# Altium project Jetson-Nano-Communication-Shield.PrjPcb
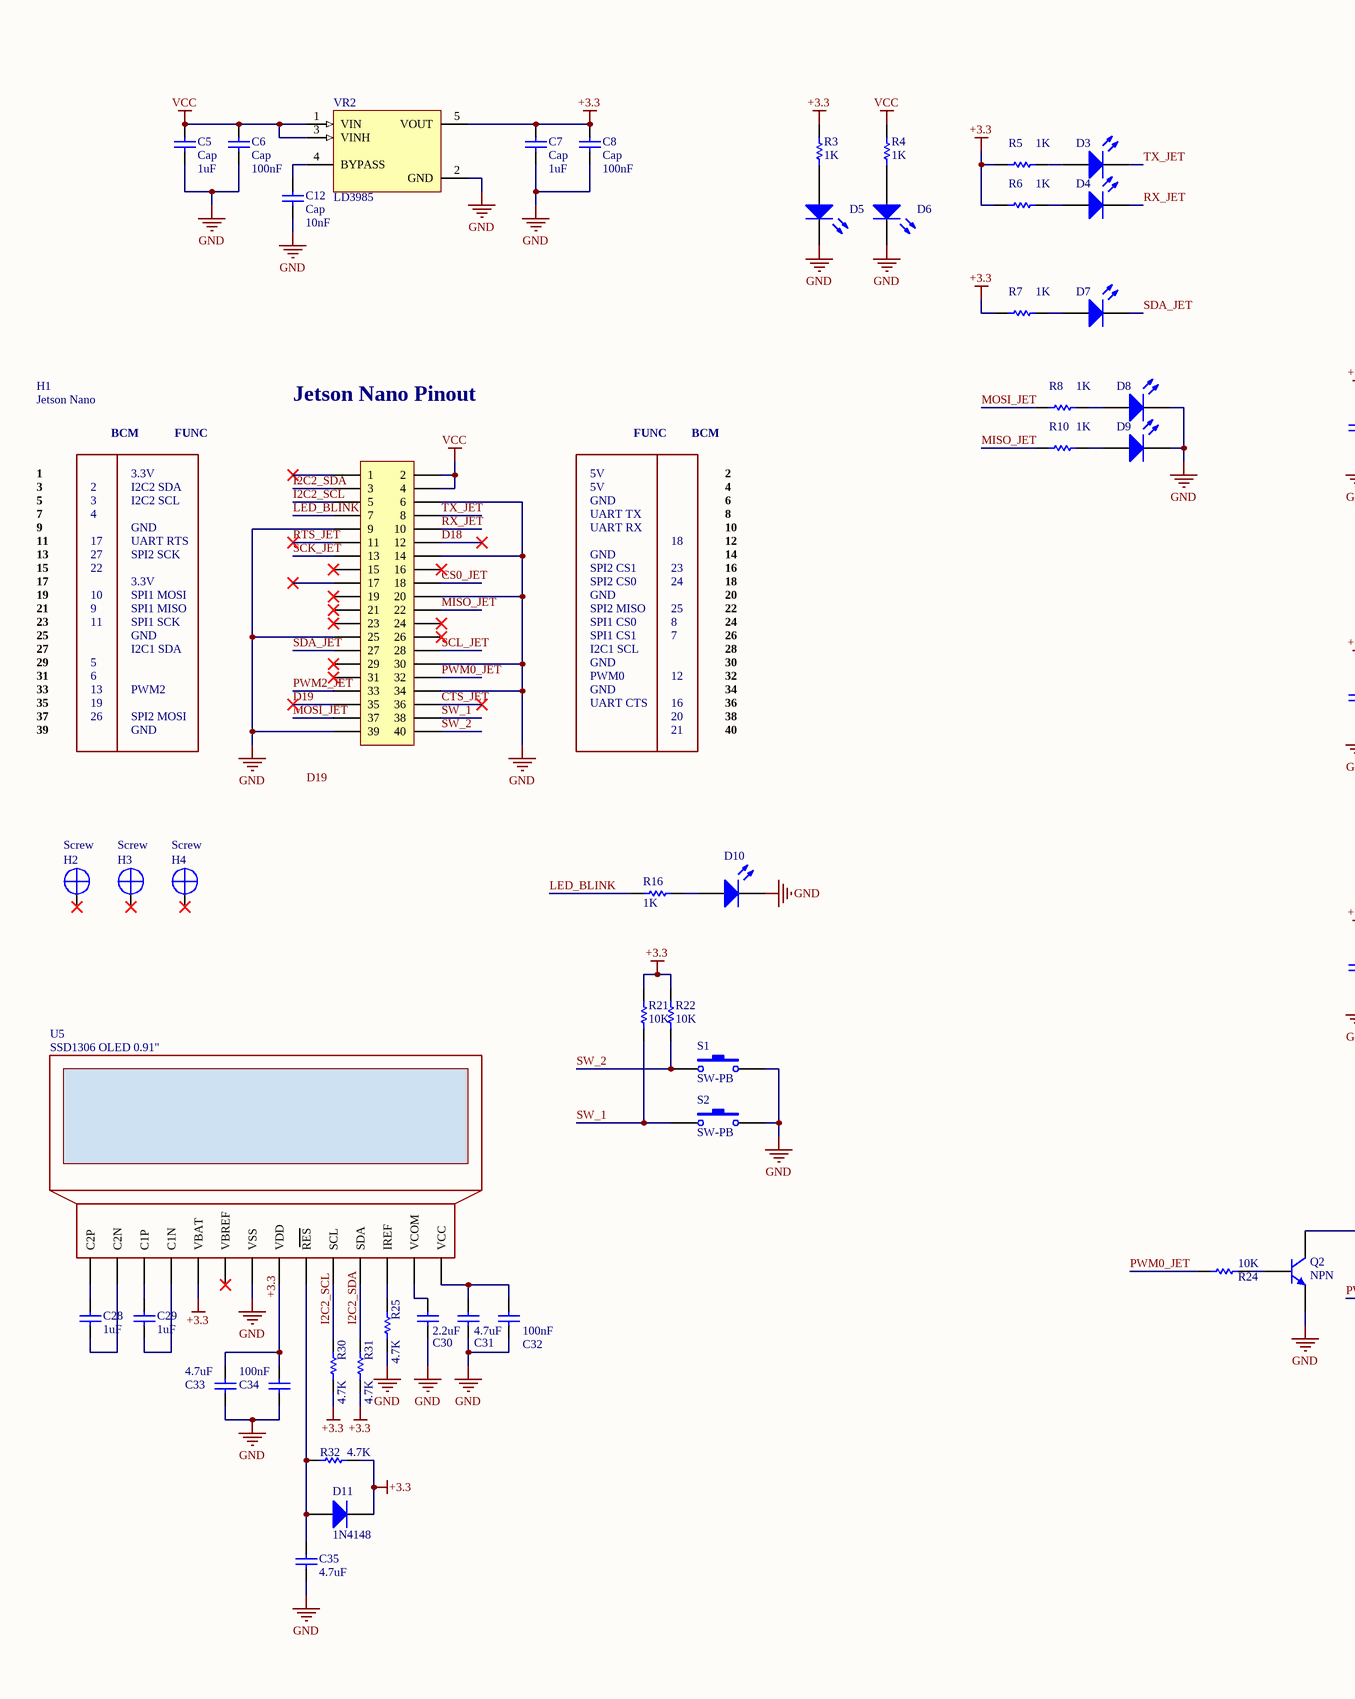
[diagram p0: Communication-Shield.SchDoc, left]
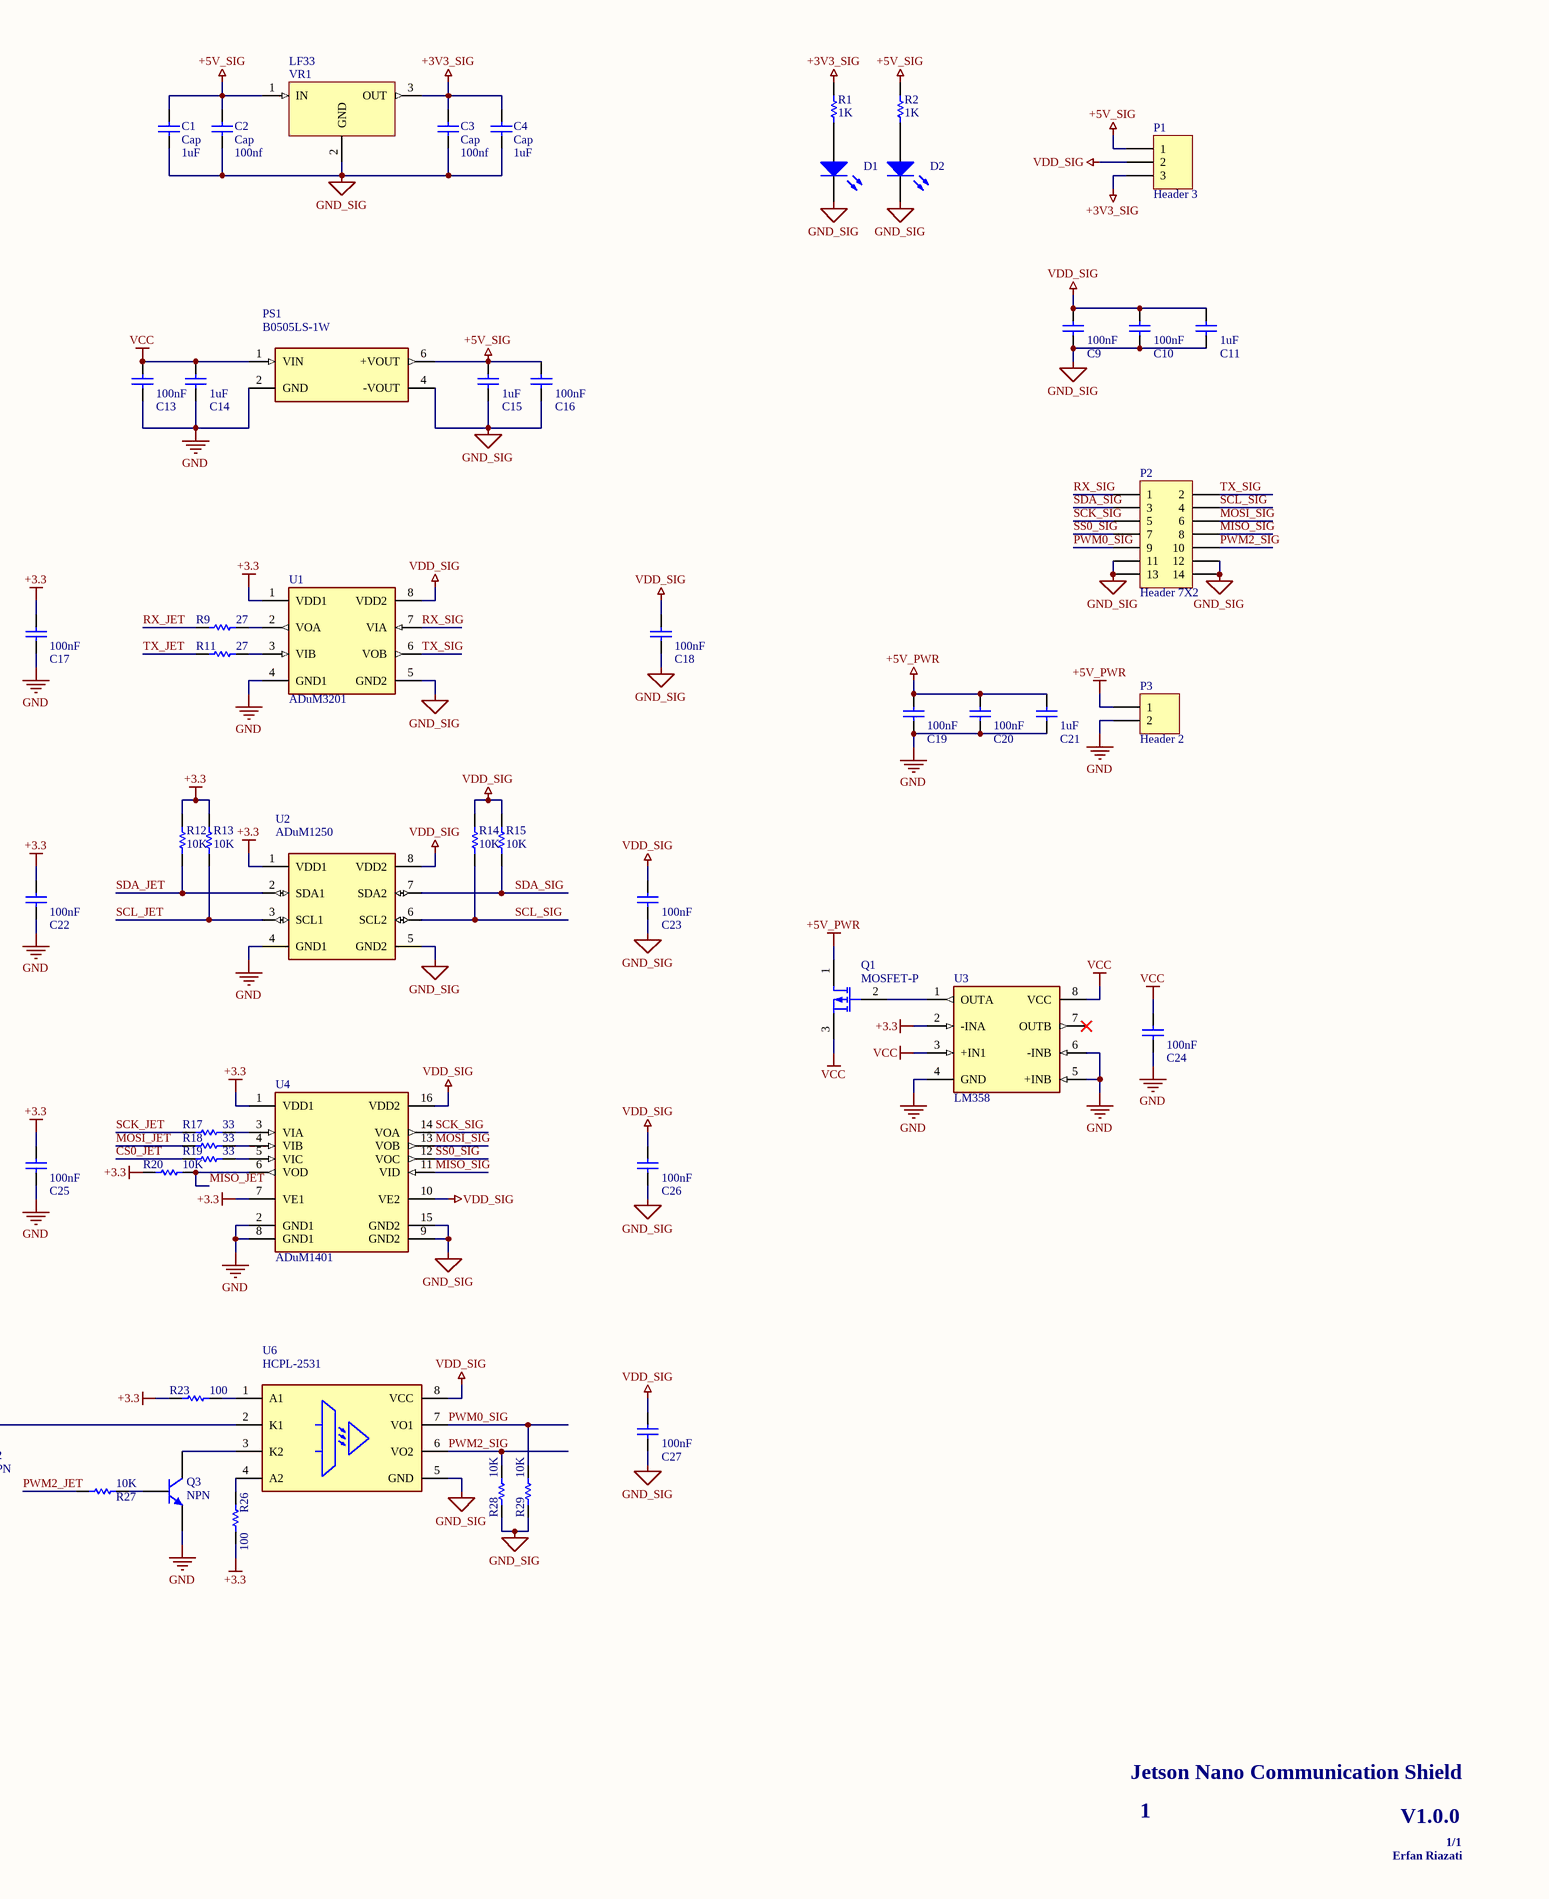
[diagram p1: Communication-Shield.SchDoc, right]
1 sheet, 99 parts. Net scope: global (net labels, ports and power ports of the same name join across sheets).
Board file: Communication-Shield.PcbDoc

## Sheet Communication-Shield.SchDoc
size A2; SheetNumber: 1; SheetTotal: 1; SPICEModelCacheUYUYBKYJ: <root> / <DocumentId>UYUYBKYJ</DocumentId> / <CacheFrame Number="0"> / <Model Name="cap" Kind="MDL"> / <Text>*Default semiconductor capacitor / .MODEL CAP C()</Text> / </Model> / <Model Name="led2" Kind="MDL"> / <Text>*Typ RED,GREEN,YELLOW,AMBER GaAs LED: Vf=2.1V Vr=4V If=40mA trr=3uS / *LED Pinout: 1=A, 2=K / .MODEL LED2 D (IS=93.1P RS=42M N=4.61 BV=4 IBV=10U / + CJO=2.97P VJ=.75 M=.333 TT=4.32U)</Text> / </Model> / <Model Name="diode" Kind="MDL"> / <Text>*Default Diode / *Diode Pinout: A,K / .MODEL DIODE D()</Text> / </Model> / <Model Name="npn" Kind="MDL"> / <Text>*Default NPN BJT / *NPN Trans Pinout: C,B,E / .MODEL NPN NPN()</Text> / </Model> / <Model Name="pmos" Kind="MDL"> / <Text>*Default P-Channel MOSFET / *Pinout: D,G,S / .MODEL PMOS PMOS()</Text> / </Model> / </CacheFrame> / </root>

### Parts
C1  Cap  value 1uF  [C0603]
C2  Cap  value 100nf  [C0603]
C3  Cap  value 100nf  [C0603]
C4  Cap  value 1uF  [C0603]
C5  Cap  value 1uF  [C0603]
C6  Cap  value 100nF  [C0603]
C7  Cap  value 1uF  [C0603]
C8  Cap  value 100nF  [C0603]
C9  value 100nF  [C0603]  (hidden comment: Cap)
C10  value 100nF  [C0603]  (hidden comment: Cap)
C11  value 1uF  [C0603]  (hidden comment: Cap)
C12  Cap  value 10nF  [C0603]
C13  value 100nF  [C0603]  (hidden comment: Cap)
C14  value 1uF  [C0603]  (hidden comment: Cap)
C15  value 1uF  [C0603]  (hidden comment: Cap)
C16  value 100nF  [C0603]  (hidden comment: Cap)
C17  value 100nF  [C0603]  (hidden comment: Cap)
C18  value 100nF  [C0603]  (hidden comment: Cap)
C19  value 100nF  [C0603]  (hidden comment: Cap)
C20  value 100nF  [C0603]  (hidden comment: Cap)
C21  value 1uF  [C0603]  (hidden comment: Cap)
C22  value 100nF  [C0603]  (hidden comment: Cap)
C23  value 100nF  [C0603]  (hidden comment: Cap)
C24  value 100nF  [C0603]  (hidden comment: Cap)
C25  value 100nF  [C0603]  (hidden comment: Cap)
C26  value 100nF  [C0603]  (hidden comment: Cap)
C27  value 100nF  [C0603]  (hidden comment: Cap)
C28  value 1uF  [C0603]  (hidden comment: Cap)
C29  value 1uF  [C0603]  (hidden comment: Cap)
C30  value 2.2uF  [C0603]  (hidden comment: Cap)
C31  value 4.7uF  [C0603]  (hidden comment: Cap)
C32  value 100nF  [C0603]  (hidden comment: Cap)
C33  value 4.7uF  [C0603]  (hidden comment: Cap)
C34  value 100nF  [C0603]  (hidden comment: Cap)
C35  value 4.7uF  [C0603]  (hidden comment: Cap)
D1  Orange  [LED-0805 Green]  (value not drawn)
D2  Orange  [LED-0805 Green]  (value not drawn)
D3  Orange  [LED-0805 Orange]  (value not drawn)
D4  Orange  [LED-0805 Orange]  (value not drawn)
D5  Orange  [LED-0805 Green]  (value not drawn)
D6  Orange  [LED-0805 Green]  (value not drawn)
D7  Orange  [LED-0805 Orange]  (value not drawn)
D8  Orange  [LED-0805 Orange]  (value not drawn)
D9  Orange  [LED-0805 Orange]  (value not drawn)
D10  Orange  [LED-0805 Orange]  (value not drawn)
D11  1N4148  [SOD-323 Diode]
H1  Jetson Nano  [Jetson Nano Header 40-Pin]
H2  Screw  [3mm Screw Hole - 2]
H3  Screw  [3mm Screw Hole - 2]
H4  Screw  [3mm Screw Hole - 2]
P1  Header 3  [Jumper Selector]
P2  Header 7X2  [IDC 14-Pin 2x7]
P3  Header 2  [XH Connector 2-Pin]
PS1  B0505LS-1W  [B0505LS-1W]
Q1  MOSFET-P  [SOT-23]
Q2  NPN  [SOT-23]
Q3  NPN  [SOT-23]
R1  value 1K  [R0603]  (hidden comment: Res1)
R2  value 1K  [R0603]  (hidden comment: Res1)
R3  value 1K  [R0603]  (hidden comment: Res1)
R4  value 1K  [R0603]  (hidden comment: Res1)
R5  value 1K  [R0603]  (hidden comment: Res1)
R6  value 1K  [R0603]  (hidden comment: Res1)
R7  value 1K  [R0603]  (hidden comment: Res1)
R8  value 1K  [R0603]  (hidden comment: Res1)
R9  value 27  [R0603]  (hidden comment: Res1)
R10  value 1K  [R0603]  (hidden comment: Res1)
R11  value 27  [R0603]  (hidden comment: Res1)
R12  value 10K  [R0603]  (hidden comment: Res1)
R13  value 10K  [R0603]  (hidden comment: Res1)
R14  value 10K  [R0603]  (hidden comment: Res1)
R15  value 10K  [R0603]  (hidden comment: Res1)
R16  value 1K  [R0603]  (hidden comment: Res1)
R17  value 33  [R0603]  (hidden comment: Res1)
R18  value 33  [R0603]  (hidden comment: Res1)
R19  value 33  [R0603]  (hidden comment: Res1)
R20  value 10K  [R0603]  (hidden comment: Res1)
R21  value 10K  [R0603]  (hidden comment: Res1)
R22  value 10K  [R0603]  (hidden comment: Res1)
R23  value 100  [R0603]  (hidden comment: Res1)
R24  value 10K  [R0603]  (hidden comment: Res1)
R25  value 4.7K  [R0603]  (hidden comment: Res1)
R26  value 100  [R0603]  (hidden comment: Res1)
R27  value 10K  [R0603]  (hidden comment: Res1)
R28  value 10K  [R0603]  (hidden comment: Res1)
R29  value 10K  [R0603]  (hidden comment: Res1)
R30  value 4.7K  [R0603]  (hidden comment: Res1)
R31  value 4.7K  [R0603]  (hidden comment: Res1)
R32  value 4.7K  [R0603]  (hidden comment: Res1)
S1  SW-PB  [Tactile Switch SMD - 2]
S2  SW-PB  [Tactile Switch SMD - 2]
U1  ADuM3201  [SOIC-8]
U2  ADuM1250  [SOIC-8]
U3  LM358  [SOIC-8]
U4  ADuM1401  [SOIC-16]
U5  SSD1306 OLED 0.91"  [SSD1306 OLED 0.91"]
U6  HCPL-2531  [SOIC-8]
VR1  LF33  [DPAK TO-252]
VR2  LD3985  [SOT23-5]

### Nets
+3.3: C7.2 C8.2 C17.1 C22.1 C25.1 C33.1 C34.1 D11.2(K) R3.1 R5.1 R6.1 R7.1 R12.2 R13.2 R20.1 R21.2 R22.2 R23.2 R26.1 R30.1 R31.1 R32.1 U1.1(VDD1) U2.1(VDD1) U3.2(-INA) U4.1(VDD1) U4.7(VE1) U5.5(VBAT) U5.8(VDD) VR2.5(VOUT)
+3V3_SIG: C3.2 C4.2 P1.3 R1.1 VR1.3(OUT)
+5V_PWR: C19.1 C20.1 C21.1 P3.1 Q1.1(D)
+5V_SIG: C1.2 C2.2 C15.1 C16.1 P1.1 PS1.6(+VOUT) R2.1 VR1.1(IN)
GND: C5.1 C6.1 C7.1 C8.1 C12.1 C13.2 C14.2 C17.2 C19.2 C20.2 C21.2 C22.2 C24.2 C25.2 C30.2 C31.2 C32.2 C33.2 C34.2 C35.2 D5.2(K) D6.2(K) D8.2(K) D9.2(K) D10.2(K) H1.6 H1.9 H1.14 H1.20 H1.25 H1.30 H1.34 H1.39 P3.2 PS1.2(GND) Q2.3(E) Q3.3(E) R25.1 S1.2 S2.2 U1.4(GND1) U2.4(GND1) U3.4(GND) U3.5(+INB) U3.6(-INB) U4.2(GND1) U4.8(GND1) U5.7(VSS) VR2.2(GND)
GND_SIG: C1.1 C2.1 C3.1 C4.1 C9.2 C10.2 C11.2 C15.2 C16.2 C18.2 C23.2 C26.2 C27.2 D1.2(K) D2.2(K) P2.11 P2.12 P2.13 P2.14 PS1.4(-VOUT) R28.2 R29.2 U1.5(GND2) U2.5(GND2) U4.9(GND2) U4.15(GND2) U6.5(GND) VR1.2(GND)
VCC: C5.2 C6.2 C13.1 C14.1 C24.1 H1.2 H1.4 PS1.1(VIN) Q1.3(S) R4.1 U3.3(+IN1) U3.8(VCC) VR2.1(VIN) VR2.3(VINH)
VDD_SIG: C9.1 C10.1 C11.1 C18.1 C23.1 C26.1 C27.1 P1.2 R14.2 R15.2 U1.8(VDD2) U2.8(VDD2) U4.10(VE2) U4.16(VDD2) U6.8(VCC)
CS0_JET: H1.18 R19.2
CTS_JET: H1.36
D18: H1.12
D19: H1.35
I2C2_SCL: H1.5 R30.2 U5.10(SCL)
I2C2_SDA: H1.3 R31.2 U5.11(SDA)
LED_BLINK: H1.7 R16.1
MISO_JET: H1.22 R10.1 R20.2 U4.6(VOD)
MISO_SIG: P2.8 U4.11(VID)
MOSI_JET: H1.37 R8.1 R18.2
MOSI_SIG: P2.6 U4.13(VOB)
PWM0_JET: H1.32 R24.2
PWM0_SIG: P2.9 R29.1 U6.7(VO1)
PWM2_JET: H1.33 R27.2
PWM2_SIG: P2.10 R28.1 U6.6(VO2)
RTS_JET: H1.11
RX_JET: D4.2(K) H1.10 R9.2
RX_SIG: P2.1 U1.7(VIA)
SCK_JET: H1.13 R17.2
SCK_SIG: P2.5 U4.14(VOA)
SCL_JET: H1.28 R13.1 U2.3(SCL1)
SCL_SIG: P2.4 R14.1 U2.6(SCL2)
SDA_JET: D7.2(K) H1.27 R12.1 U2.2(SDA1)
SDA_SIG: P2.3 R15.1 U2.7(SDA2)
SS0_SIG: P2.7 U4.12(VOC)
SW_1: H1.38 R21.1 S2.1
SW_2: H1.40 R22.1 S1.1
TX_JET: D3.2(K) H1.8 R11.2
TX_SIG: P2.2 U1.6(VOB)
NetC12_2: C12.2 VR2.4(BYPASS)
NetC28_1: C28.1 U5.1(C2P)
NetC28_2: C28.2 U5.2(C2N)
NetC29_1: C29.1 U5.3(C1P)
NetC29_2: C29.2 U5.4(C1N)
NetC30_1: C30.1 U5.13(VCOM)
NetC31_1: C31.1 C32.1 U5.14(VCC)
NetC35_1: C35.1 D11.1(A) R32.2 U5.9(RES)
NetD1_1: D1.1(A) R1.2
NetD2_1: D2.1(A) R2.2
NetD3_1: D3.1(A) R5.2
NetD4_1: D4.1(A) R6.2
NetD5_1: D5.1(A) R3.2
NetD6_1: D6.1(A) R4.2
NetD7_1: D7.1(A) R7.2
NetD8_1: D8.1(A) R8.2
NetD9_1: D9.1(A) R10.2
NetD10_1: D10.1(A) R16.2
NetQ1_2: Q1.2(G) U3.1(OUTA)
NetQ2_1: Q2.1(C) U6.2(K1)
NetQ2_2: Q2.2(B) R24.1
NetQ3_1: Q3.1(C) U6.3(K2)
NetQ3_2: Q3.2(B) R27.1
NetR9_1: R9.1 U1.2(VOA)
NetR11_1: R11.1 U1.3(VIB)
NetR17_1: R17.1 U4.3(VIA)
NetR18_1: R18.1 U4.4(VIB)
NetR19_1: R19.1 U4.5(VIC)
NetR23_1: R23.1 U6.1(A1)
NetR25_2: R25.2 U5.12(IREF)
NetR26_2: R26.2 U6.4(A2)

Not connected (* = marked no-connect by the designer): H1 1* 15* 16* 17* 19* 21* 23* 24* 26* 29* 31*; H2 S*; H3 S*; H4 S*; U3 7(OUTB)*; U5 6(VBREF)*

### Notes on the sheet
- Jetson Nano Pinout
- Jetson Nano Communication Shield
- 1
- Erfan Riazati
- V1.0.0
- 1/1
- Labels drawn without touching a wire or pin: D19
- (in symbol Jetson Nano) BCM; FUNC; 3.3V; 5V; I2C2 SDA; I2C2 SCL; GND; UART TX; UART RX; UART RTS; SPI2 SCK; SPI2 CS1; SPI2 CS0; SPI1 MOSI; SPI1 MISO; SPI2 MISO; SPI1 SCK; SPI1 CS0; SPI1 CS1; I2C1 SDA; I2C1 SCL; PWM0; PWM2; UART CTS; SPI2 MOSI

### Library data of the parts
C1-C35 = Cap: Capacitor; Published: 8-Jun-2000; LatestRevisionDate: 17-Jul-2002; LatestRevisionNote: Re-released for DXP Platform.; PackageReference: RAD-0.3; Publisher: Altium Limited; PackageDescription: Radial Cap, Thru-Hole; 2 Leads; 0.3 in Pin Spacing
D1-D10 = LED2: Typical RED, GREEN, YELLOW, AMBER GaAs LED; Published: 8-Jun-2000; LatestRevisionDate: 17-Jul-2002; LatestRevisionNote: Re-released for DXP Platform.; PackageVersion: Feb-2002; PackageReference: 3.2X1.6X1.1; Publisher: Altium Limited; PackageDescription: SM LED; 2 Flat Leads
D11 = Diode: Default Diode; Published: 8-Jun-2000; LatestRevisionDate: 17-Jul-2002; LatestRevisionNote: Re-released for DXP Platform.; PackageVersion: Sep-1996; PackageReference: SMC; Publisher: Altium Limited; PackageDescription: DO-214-AB/SMC; 2 C-Bend Leads; Body 7.9 x 5.9 mm, inc. leads (LxW); Code_JEDEC: DO-214-AB
H2-H4 = Screw: PCB MOUNTING SCREW
P1 = Header 3: Header, 3-Pin; LatestRevisionDate: 17-Jul-2002; LatestRevisionNote: Re-released for DXP Platform.; Publisher: Altium Limited
P2 = Header 7X2: Header, 7-Pin, Dual row; LatestRevisionDate: 17-Jul-2002; LatestRevisionNote: Re-released for DXP Platform.; Publisher: Altium Limited
P3 = Header 2: Header, 2-Pin; LatestRevisionDate: 17-Jul-2002; LatestRevisionNote: Re-released for DXP Platform.; Publisher: Altium Limited
PS1 = B0505LS-1W: Compact, isolated DC-DC Converter module
Q1 = MOSFET-P: P-Channel MOSFET; Published: 8-Jun-2000; LatestRevisionDate: 17-Jul-2002; LatestRevisionNote: Re-released for DXP Platform.; PackageVersion: 1995/1996; PackageReference: E3; Publisher: Altium Limited; PackageDescription: TO, Flat Index; 3 In-Line, Axial Leads; Body Dia. 4.6mm; Lead Dia. 0.5 mm (max)
Q2 Q3 = NPN: NPN Bipolar Transistor; Published: 8-Jun-2000; LatestRevisionDate: 17-Jul-2002; LatestRevisionNote: Re-released for DXP Platform.; PackageReference: TO-226-AA; Publisher: Altium Limited; PackageDescription: TO, Flat Index; 3 In-Line, Axial Leads; Body Dia. 4.8mm; Leads 0.55 x 0.51 mm (max); Code_JEDEC: TO-226-AA
R1-R32 = Res1: Resistor; Published: 8-Jun-2000; LatestRevisionDate: 17-Jul-2002; LatestRevisionNote: Re-released for DXP Platform.; PackageReference: AXIAL-0.3; Publisher: Altium Limited; PackageDescription: Axial Device, Thru-Hole; 2 Leads; 0.3 in Pin Spacing
S1 S2 = SW-PB: Switch; Published: 24-Mar-1999; LatestRevisionDate: 17-Jul-2002; LatestRevisionNote: Re-released for DXP Platform.; PackageReference: SPST-2; Publisher: Altium Limited; PackageDescription: Switch; 2 Leads
U1 = ADuM3201: Dual-Channel, Digital Isolators, Enhanced System-Level ESD Reliability
U2 = ADuM1250: Hot Swappable, Dual I2C Isolators
U3 = LM358: 2-Channel, 1MHz, industry standard, 32V Op-Amp
U4 = ADuM1401: Quad-Channel Digital Isolators
U5 = SSD1306 OLED 0.91": This is a general OLED display Module, 0.91inch diagonal, 128x32 pixels, with embedded controller, communicating via I2C interface.
U6 = HCPL-2531: optocouplers consist of an AlGaAs LED optically coupled to a / high speed photodetector transistor.
VR1 = LF33: Very low drop voltage regulator with inhibit function
VR2 = LD3985: Ultra low drop and low noise BiCMOS voltage regulators